# EAGLE design schematic (EAGLE 9.0.0)
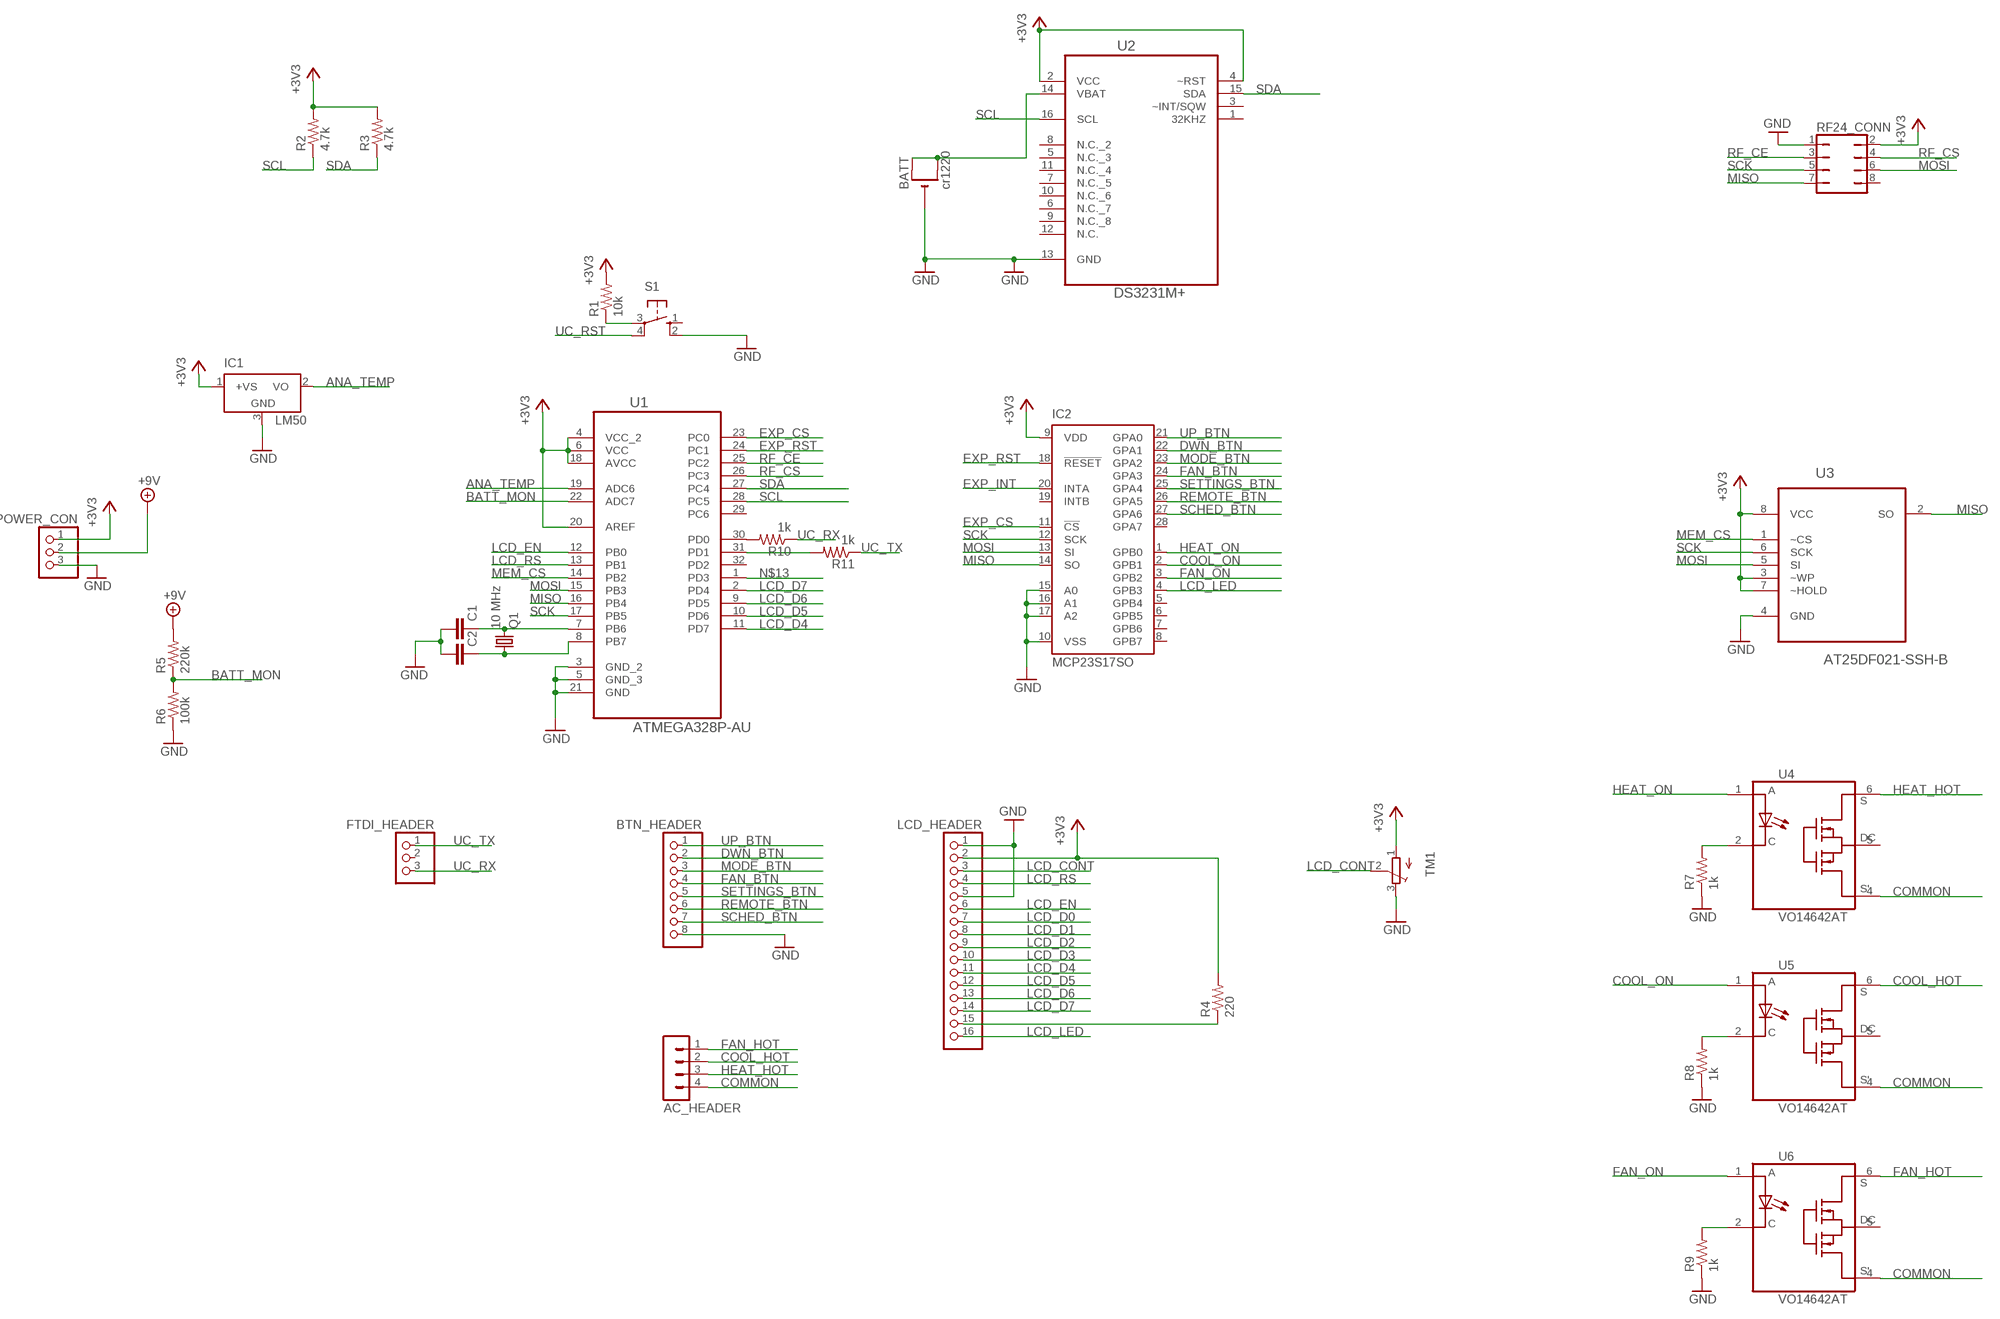
[diagram p0: schematic, sheet 1]

## Parts
AC_HEADER  MA04-1  [MA04-1]
BATT  cr1220  CR1220SMT  [CR1220-SMD]
BTN_HEADER  PINHD-1X8BIG  [1X08-BIG]
C1  C-EUC0402  [C0402]
C2  C-EUC0402  [C0402]
FTDI_HEADER  PINHD-1X3  [1X03]
IC1  LM50  [SOT23]
IC2  MCP23S17SO  [SO28W]
LCD_HEADER  PINHD-1X16  [1X16]
POWER_CON  PINHD-1X3  [1X03]
Q1  10 MHz  FC-12M  [FC-12M]
R1  10k  R-US_R0402  [R0402]
R2  4.7k  R-US_R0402  [R0402]
R3  4.7k  R-US_R0402  [R0402]
R4  220  R-US_R0402  [R0402]
R5  220k  R-US_R0402  [R0402]
R6  100k  R-US_R0402  [R0402]
R7  1k  R-US_R0402  [R0402]
R8  1k  R-US_R0402  [R0402]
R9  1k  R-US_R0402  [R0402]
R10  1k  R-US_R0402  [R0402]
R11  1k  R-US_R0402  [R0402]
RF24_CONN  JP4Q  [JP4Q]
S1  10-XX  [B3F-10XX]
TM1  TRIMPOTTC33X  [TC33X]
U1  ATMEGA328P-AU  [QFP80P900X900X120-32N]
U2  DS3231M+  [SOIC127P1032X265-16N]
U3  AT25DF021-SSH-B  [SOIC127P600X175-8N]
U4  VO14642AT  [DIP762W50P254L730H410Q6]
U5  VO14642AT  [DIP762W50P254L730H410Q6]
U6  VO14642AT  [DIP762W50P254L730H410Q6]

## Nets
+3V3: IC1.1(+VS) IC2.9(VDD) LCD_HEADER.2 POWER_CON.1 R1.2 R2.2 R3.2 R4.2 RF24_CONN.2 TM1.1(A) U1.4(VCC_2) U1.6(VCC) U1.18(AVCC) U1.20(AREF) U2.2(VCC) U2.4(~RST) U3.3(~WP) U3.7(~HOLD) U3.8(VCC)
+9V: POWER_CON.2 R5.2
ANA_TEMP: IC1.2(VO) U1.19(ADC6)
BATT_MON: R5.1 R6.2 U1.22(ADC7)
COMMON: AC_HEADER.4 U4.4(S') U5.4(S') U6.4(S')
COOL_HOT: AC_HEADER.2 U5.6(S)
COOL_ON: IC2.2(GPB1) U5.1(A)
DWN_BTN: BTN_HEADER.2 IC2.22(GPA1)
EXP_CS: IC2.11(!CS) U1.23(PC0)
EXP_INT: IC2.20(INTA)
EXP_RST: IC2.18(!RESET) U1.24(PC1)
FAN_BTN: BTN_HEADER.4 IC2.24(GPA3)
FAN_HOT: AC_HEADER.1 U6.6(S)
FAN_ON: IC2.3(GPB2) U6.1(A)
GND: BATT.- BTN_HEADER.8 C1.2 C2.2 IC1.3(GND) IC2.10(VSS) IC2.15(A0) IC2.16(A1) IC2.17(A2) LCD_HEADER.1 LCD_HEADER.5 POWER_CON.3 R6.1 R7.1 R8.1 R9.1 RF24_CONN.1 S1.2(S1) TM1.3(E) U1.3(GND_2) U1.5(GND_3) U1.21(GND) U2.13(GND) U3.4(GND)
HEAT_HOT: AC_HEADER.3 U4.6(S)
HEAT_ON: IC2.1(GPB0) U4.1(A)
LCD_CONT: LCD_HEADER.3 TM1.2(S)
LCD_D0: LCD_HEADER.7
LCD_D1: LCD_HEADER.8
LCD_D2: LCD_HEADER.9
LCD_D3: LCD_HEADER.10
LCD_D4: LCD_HEADER.11 U1.11(PD7)
LCD_D5: LCD_HEADER.12 U1.10(PD6)
LCD_D6: LCD_HEADER.13 U1.9(PD5)
LCD_D7: LCD_HEADER.14 U1.2(PD4)
LCD_EN: LCD_HEADER.6 U1.12(PB0)
LCD_LED: IC2.4(GPB3) LCD_HEADER.16
LCD_RS: LCD_HEADER.4 U1.13(PB1)
MEM_CS: U1.14(PB2) U3.1(~CS)
MISO: IC2.14(SO) RF24_CONN.7 U1.16(PB4) U3.2(SO)
MODE_BTN: BTN_HEADER.3 IC2.23(GPA2)
MOSI: IC2.13(SI) RF24_CONN.6 U1.15(PB3) U3.5(SI)
N$1: C1.1 Q1.2 U1.7(PB6)
N$2: C2.1 Q1.1 U1.8(PB7)
N$3: LCD_HEADER.15 R4.1
N$4: R1.1 S1.3(P)
N$5: R7.2 U4.2(C)
N$6: R8.2 U5.2(C)
N$7: R9.2 U6.2(C)
N$8: BATT.+$1(+) BATT.+$2(+1) U2.14(VBAT)
N$9: R10.2 U1.30(PD0)
N$10: R11.2 U1.31(PD1)
N$13: U1.1(PD3)
REMOTE_BTN: BTN_HEADER.6 IC2.26(GPA5)
RF_CE: RF24_CONN.3 U1.25(PC2)
RF_CS: RF24_CONN.4 U1.26(PC3)
SCHED_BTN: BTN_HEADER.7 IC2.27(GPA6)
SCK: IC2.12(SCK) RF24_CONN.5 U1.17(PB5) U3.6(SCK)
SCL: R2.1 U1.28(PC5) U2.16(SCL)
SDA: R3.1 U1.27(PC4) U2.15(SDA)
SETTINGS_BTN: BTN_HEADER.5 IC2.25(GPA4)
UC_RST: S1.4(P1)
UC_RX: FTDI_HEADER.3 R10.1
UC_TX: FTDI_HEADER.1 R11.1
UP_BTN: BTN_HEADER.1 IC2.21(GPA0)
Unconnected: FTDI_HEADER.2 IC2.5(GPB4) IC2.6(GPB5) IC2.7(GPB6) IC2.8(GPB7) IC2.19(INTB) IC2.28(GPA7) RF24_CONN.8 S1.1(S) U1.29(PC6) U1.32(PD2) U2.1(32KHZ) U2.3(~INT/SQW) U2.5(N.C._3) U2.6(N.C._7) U2.7(N.C._5) U2.8(N.C._2) U2.9(N.C._8) U2.10(N.C._6) U2.11(N.C._4) U2.12(N.C.) U4.5(DC) U5.5(DC) U6.5(DC)

## Library data of the parts
AC_HEADER = con-lstb:MA04-1: PIN HEADER; OC_FARNELL: unknown; OC_NEWARK: unknown
BATT = adafruit:CR1220: CR1216/CR1220/CR1225 12mm 3V lithium coin cell Great for battery packup. Both SMT and THM holders. Note the THM package has the ground pads on both sides of the PCB so that the masks are the same - this reduces the cost
BTN_HEADER = adafruit:PINHD-1X8: PIN HEADER
C1 C2 = rcl:C-EU: CAPACITOR, European symbol; SPICEPREFIX: C
FTDI_HEADER POWER_CON = adafruit:PINHD-1X3: PIN HEADER
IC1 = linear:LM50: SOT-23 Single-Supply Centigrade Temperature Sensor Vout = (10mV/°C x Temp °C) +5mmmV Source: http://cache.national.com/ds/LM/LM50.pdf
IC2 = microchip:MCP23S17: http://ww1.microchip.com/downloads/en/DeviceDoc/21952a.pdf Source: http://ww1.microchip.com/downloads/en/DeviceDoc/21952a.pdf; MF: MICROCHIP; MPN: MCP23S17-E/SO; OC_FARNELL: unknown; OC_NEWARK: 31K2950
LCD_HEADER = pinhead:PINHD-1X16: PIN HEADER
Q1 = crystal:FC-12M: kHz RANGE CRYSTAL UNIT LOW PROFILE SMD Source: Epson Toyocom FC-12M.pdf
R1-R11 = resistor:R-US_: RESISTOR, American symbol
RF24_CONN = jumper:JP4Q: JUMPER
S1 = switch-omron:10-XX: OMRON SWITCH; MPN: B3F-1000; OC_FARNELL: 176432; OC_NEWARK: 36M3542
TM1 = adafruit:TRIMPOT: SMT trimmer potentiometer part number TC33X http://www.ladyada.net/library/eagle
U1 = Atmel_By_element14_Batch_1-00:ATMEGA328P-AU: 8-bit Microcontroller with In-System Programmable Flash; MPN: ATMEGA328P-AU; OC_FARNELL: 1715486; OC_NEWARK: 14R4631; PACKAGE: TQFP-32; SUPPLIER: Atmel
U2 = Maxim_By_element14_Batch_1:DS3231M+: ±5ppm, I2C Real-Time Clock; MPN: DS3231M+; OC_FARNELL: -; OC_NEWARK: 79R7965; PACKAGE: SO-16; SUPPLIER: Maxim
U3 = Atmel_By_element14_Batch_1-00:AT25DF021-SSH-B: 2-Megabit Minimum SPI Serial Flash Memory; MPN: AT25DF021-SSH-B; OC_FARNELL: 1715438; OC_NEWARK: 15R0303; PACKAGE: SOIC-8; SUPPLIER: Atmel
U4-U6 = VO14642AT:VO14642AT; DESCRIPTION: VO14642 Series SPST-NO 50 mA 60 V Through Hole Solid State Relay - DIP-6; DIGI-KEY_PART_NUMBER: VO14642AT-ND; DIGI-KEY_PURCHASE_URL: https://www.digikey.com/product-detail/en/vishay-semiconductor-opto-division/VO14642AT/VO14642AT-ND/4074374?utm_source=snapeda&utm_medium=aggregator&utm_campaign=symbol; MF: Vishay; MP: VO14642AT; PACKAGE: DIP-6 Vishay

## Board
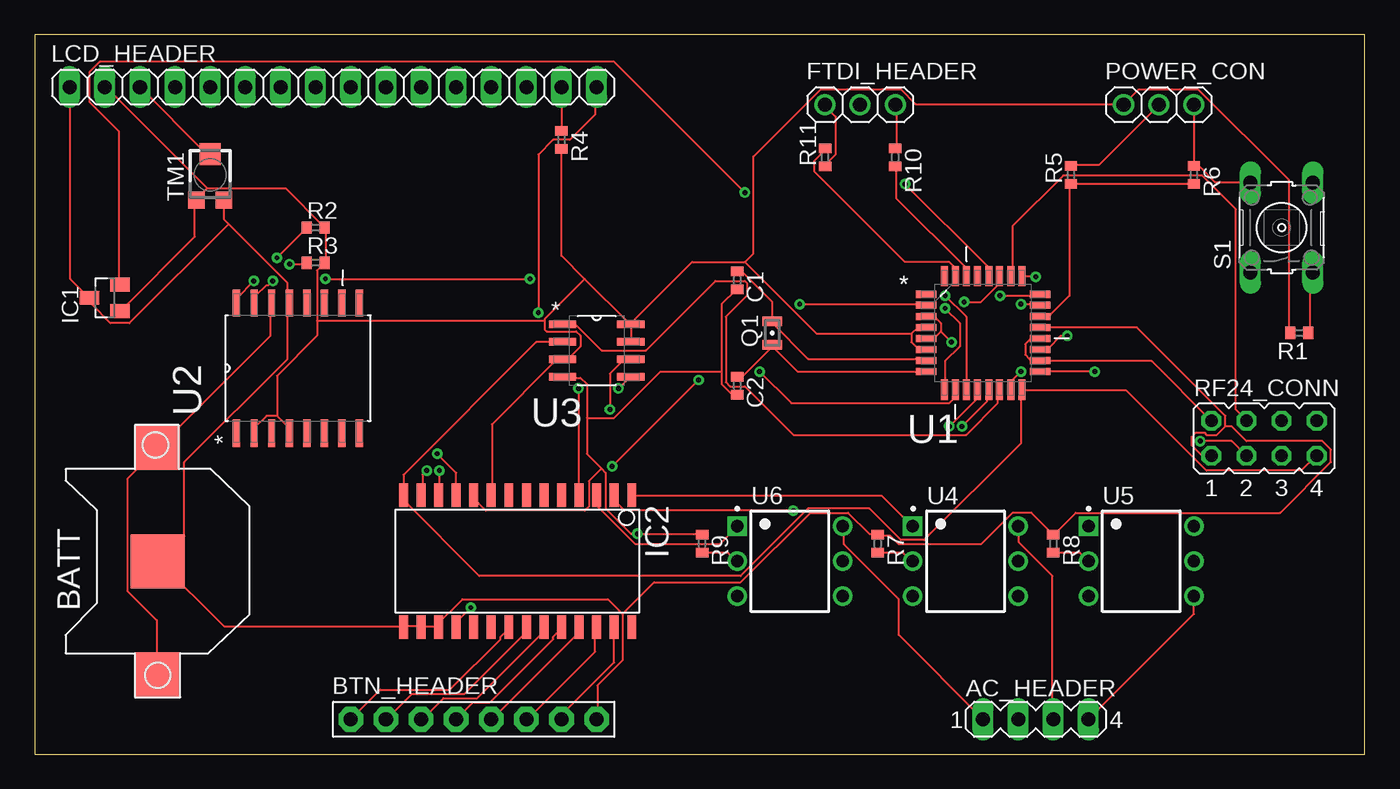
[diagram p1: board, top side]
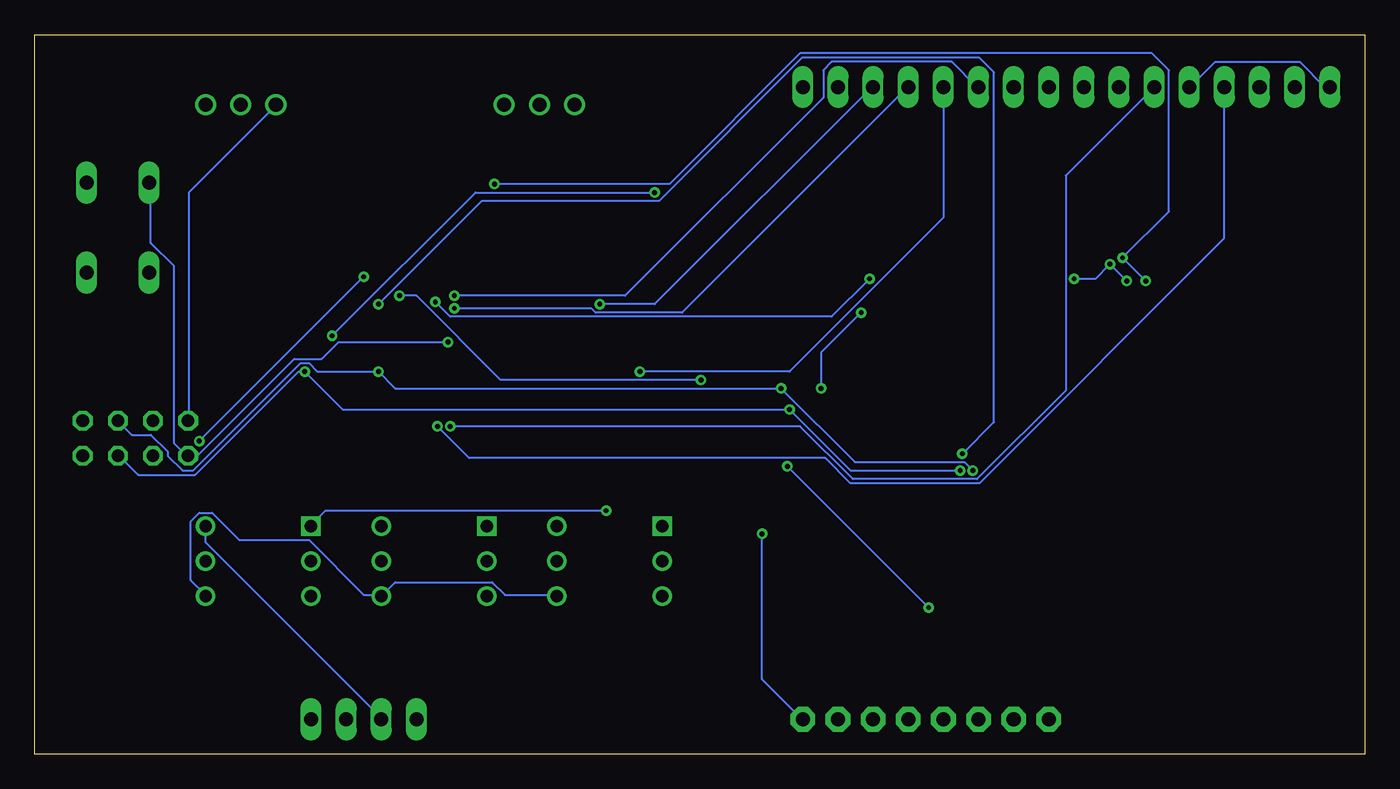
[diagram p2: board, bottom side, seen from below]

Size 96.19 x 52.06 mm. Coordinates in mm from the lower left corner, seen from the top.
Outline: 0,0 96.19,0 96.19,52.06 0,52.06 0,0
Copper layers (1*16): Top 0.035mm / dielectric 1.5mm / Bottom 0.035mm
Design rules "default": minimum track width 6mil, minimum drill 0.35mm, track to track 6mil, track to pad 6mil, pad to pad 6mil, via to via 6mil, smd to smd 6mil, copper to edge 40mil, drill to drill 6mil, minimum pad ring 10mil, minimum via ring 8mil, stop-mask expansion 4mil, vias tented up to drill 0mil, thermal gap 10mil

### Footprints (pad centres in the part's own frame; a part is rotated, then mirrored left to right if it is on the bottom)
MA04-1 = drill 1.016 long: 1 -3.81,0; 2 -1.27,0; 3 1.27,0; 4 3.81,0
CR1220-SMD = smd 3.2 x 3.2: +$1 -8.2,0; +$2 8.2,0 | smd 3.9 x 3.9: - 0,0
1X08-BIG = drill 1.016 pad 1.778 octagon: 1 -8.89,0; 2 -6.35,0; 3 -3.81,0; 4 -1.27,0; 5 1.27,0; 6 3.81,0; 7 6.35,0; 8 8.89,0
C0402 = smd 0.7 x 0.9: 1 -0.65,0; 2 0.65,0
1X03 = drill 1.016: 1 -2.54,0; 2 0,0; 3 2.54,0
SOT23 = smd 1 x 1.4: 1 -0.95,-1.1; 2 0.95,-1.1; 3 0,1.1
SO28W = smd 0.65 x 1.7: 1 -7.62,-4.78; 2 -6.35,-4.78; 3 -5.08,-4.78; 4 -3.81,-4.78; 5 -2.54,-4.78; 6 -1.27,-4.78; 7 0,-4.78; 8 1.27,-4.78; 9 2.54,-4.78; 10 3.81,-4.78; 11 5.08,-4.78; 12 6.35,-4.78; 13 7.62,-4.78; 14 8.89,-4.78; 15 8.89,4.78; 16 7.62,4.78; 17 6.35,4.78; 18 5.08,4.78; 19 3.81,4.78; 20 2.54,4.78; 21 1.27,4.78; 22 0,4.78; 23 -1.27,4.78; 24 -2.54,4.78; 25 -3.81,4.78; 26 -5.08,4.78; 27 -6.35,4.78; 28 -7.62,4.78
1X16 = drill 1.016 long: 1 -19.05,0; 2 -16.51,0; 3 -13.97,0; 4 -11.43,0; 5 -8.89,0; 6 -6.35,0; 7 -3.81,0; 8 -1.27,0; 9 1.27,0; 10 3.81,0; 11 6.35,0; 12 8.89,0; 13 11.43,0; 14 13.97,0; 15 16.51,0; 16 19.05,0
FC-12M = smd 0.7 x 1.4: 1 -0.85,0; 2 0.85,0
R0402 = smd 0.7 x 0.9: 1 -0.65,0; 2 0.65,0
JP4Q = drill 0.914 octagon: 1 -3.81,-1.27; 2 -3.81,1.27; 3 -1.27,-1.27; 4 -1.27,1.27; 5 1.27,-1.27; 6 1.27,1.27; 7 3.81,-1.27; 8 3.81,1.27
B3F-10XX = drill 1.016 long: 1 -3.251,2.261; 2 3.251,2.261; 3 -3.251,-2.261; 4 3.251,-2.261
TC33X = smd 1.2 x 1.2: 1 -1,-1.825; 3 1,-1.825 | smd 1.5 x 1.6: 2 0,1.5
QFP80P900X900X120-32N = smd 1.473 x 0.508: 1 -4.115,2.794; 2 -4.115,2.007; 3 -4.115,1.194; 4 -4.115,0.406; 5 -4.115,-0.406; 6 -4.115,-1.194; 7 -4.115,-2.007; 8 -4.115,-2.794; 17 4.115,-2.794; 18 4.115,-2.007; 19 4.115,-1.194; 20 4.115,-0.406; 21 4.115,0.406; 22 4.115,1.194; 23 4.115,2.007; 24 4.115,2.794 | smd 0.508 x 1.473: 9 -2.794,-4.115; 10 -2.007,-4.115; 11 -1.194,-4.115; 12 -0.406,-4.115; 13 0.406,-4.115; 14 1.194,-4.115; 15 2.007,-4.115; 16 2.794,-4.115; 25 2.794,4.115; 26 2.007,4.115; 27 1.194,4.115; 28 0.406,4.115; 29 -0.406,4.115; 30 -1.194,4.115; 31 -2.007,4.115; 32 -2.794,4.115
SOIC127P1032X265-16N = smd 1.981 x 0.533: 1 -4.699,4.445; 2 -4.699,3.175; 3 -4.699,1.905; 4 -4.699,0.635; 5 -4.699,-0.635; 6 -4.699,-1.905; 7 -4.699,-3.175; 8 -4.699,-4.445; 9 4.699,-4.445; 10 4.699,-3.175; 11 4.699,-1.905; 12 4.699,-0.635; 13 4.699,0.635; 14 4.699,1.905; 15 4.699,3.175; 16 4.699,4.445
SOIC127P600X175-8N = smd 1.981 x 0.559: 1 -2.464,1.905; 2 -2.464,0.635; 3 -2.464,-0.635; 4 -2.464,-1.905; 5 2.464,-1.905; 6 2.464,-0.635; 7 2.464,0.635; 8 2.464,1.905
DIP762W50P254L730H410Q6 = drill 0.9 pad 1.4 square: 1 -3.81,2.54 | drill 0.9 pad 1.4: 2 -3.81,0; 3 -3.81,-2.54; 4 3.81,-2.54; 5 3.81,0; 6 3.81,2.54

### Placement (x,y rotation side)
AC_HEADER  72.39,2.54 0 top
BATT  8.89,13.97 90 top
BTN_HEADER  31.75,2.54 0 top
C1  50.8,34.29 270 top
C2  50.8,26.67 270 top
FTDI_HEADER  59.69,46.99 0 top
IC1  5.08,33.02 90 top
IC2  35.56,13.97 180 top
LCD_HEADER  21.59,48.26 0 top
POWER_CON  81.28,46.99 0 top
Q1  53.34,30.48 90 top
R1  91.44,30.48 180 top
R2  20.32,38.1 0 top
R3  20.32,35.56 0 top
R4  38.1,44.45 270 top
R5  74.93,41.91 90 top
R6  83.82,41.91 270 top
R7  60.96,15.24 270 top
R8  73.66,15.24 270 top
R9  48.26,15.24 270 top
R10  62.23,43.18 270 top
R11  57.15,43.18 90 top
RF24_CONN  88.9,22.86 0 top
S1  90.17,38.1 90 top
TM1  12.7,41.91 0 top
U1  68.58,30.48 0 top
U2  19.05,27.94 90 top
U3  40.64,29.21 0 top
U4  67.31,13.97 0 top
U5  80.01,13.97 0 top
U6  54.61,13.97 0 top

### Tracks (layer width: path | path; a pad name or v marks a point on that pad's centre or on a via)
+3V3
  Top 0.152: 17.53,24.49 16.76,24.49 16,23.72 16,23.27 U2.2 | 17.53,24.49 18.29,23.72 18.29,23.27 U2.4 | IC1.1 6.25,32.11 11.58,37.44 11.58,40.03 TM1.1 11.73,40.18 12.5,40.95 | 12.5,40.95 18.14,40.95 20.88,38.2 R2.2 21.03,38.05 21.03,35.61 R3.2 20.88,35.46 20.42,35 20.42,31.34 | 17.53,24.49 17.53,27.38 20.42,30.28 20.42,31.34 | 12.5,40.95 5.18,48.26 LCD_HEADER.2 | U1.20 72.69,29.97 71.93,29.97 71.63,29.67 71.63,28.9 71.93,28.6 72.69,28.6 U1.18 72.69,28.45 80.77,28.45 RF24_CONN.2 | R1.2 90.68,30.58 90.68,41.55 84.12,48.11 79.86,48.11 POWER_CON.1 78.64,47.04 63.7,47.04 62.64,48.11 56.84,48.11 51.97,43.23 51.97,36.22 51.36,35.61 | IC2.9 33.07,18.85 33.07,23.88 37.64,28.45 38.1,28.45 U3.3 38.25,28.6 38.56,28.6 39.47,29.51 39.47,30.28 39.17,30.58 37.03,30.58 36.88,30.73 36.88,31.34 | 63.4,30.43 63.4,29.82 63.86,29.36 64.47,29.36 U1.6 | 63.4,30.43 63.86,30.89 U1.4 | R4.2 38.1,36.07 39.78,34.39 | 39.78,34.39 42.98,31.19 U3.8 | U3.7 43.13,29.97 43.13,31.04 U3.8 | 63.4,30.43 56.54,30.43 51.36,35.61 | 51.36,35.61 47.55,35.61 43.13,31.19 U3.8 | 36.88,31.34 36.88,31.5 39.78,34.39 | 36.88,31.34 20.42,31.34
  Bottom 0.152: RF24_CONN.2 85.04,24.18 85.04,40.64 78.79,46.89 POWER_CON.1
+9V
  Top 0.152: R5.2 74.98,42.62 76.96,42.62 81.23,46.89 POWER_CON.2
ANA_TEMP  (via drill 0.35)
  Top 0.152: v51.36,40.64 41.91,50.09 4.72,50.09 3.96,49.33 3.96,47.19 6.1,45.06 6.1,34.09 IC1.2 | v74.68,30.28 74.22,30.28 73.3,29.36 72.69,29.36 U1.19
  Bottom 0.152: v51.36,40.64 64.31,40.64 v74.68,30.28
BATT_MON
  Top 0.152: R6.2 74.98,41.25 R5.1 74.83,41.25 74.83,33.17 73.46,31.8 72.69,31.8 U1.22
COMMON
  Top 0.152: U5.4 83.82,10.16 AC_HEADER.4
  Bottom 0.152: U6.4 58.52,11.53 62.18,11.53 63.09,12.45 70.1,12.45 U4.4 71.17,11.53 72.39,11.53 76.35,15.49 81.38,15.49 83.36,17.47 84.28,17.47 84.89,16.87 84.89,12.6 83.82,11.53 U5.4
COOL_HOT
  Bottom 0.152: U5.6 83.82,15.34 71.02,2.54 AC_HEADER.2
COOL_ON  (via drill 0.35)
  Top 0.152: IC2.2 41.91,18.39 42.67,17.63 v54.86,17.63
  Bottom 0.152: v54.86,17.63 75.13,17.63 76.2,16.56 U5.1
DWN_BTN
  Top 0.152: IC2.22 35.51,9.09 35.51,8.79 31.09,4.37 27.28,4.37 25.45,2.54 BTN_HEADER.2
EXP_CS  (via drill 0.35)
  Top 0.152: v71.32,32.56 72.69,32.56 U1.23 | v29.11,21.74 30.48,20.37 IC2.11
  Bottom 0.152: v71.32,32.56 63.86,40.03 51.05,40.03 40.69,50.39 27.89,50.39 26.82,49.33 26.82,24.03 v29.11,21.74
EXP_RST  (via drill 0.35)
  Top 0.152: v69.8,33.17 72.69,33.17 U1.24 | v41.76,20.83 v48.01,27.08 | v31.55,10.62 30.48,9.55 IC2.18
  Bottom 0.152: v69.8,33.17 68.58,33.17 62.48,27.08 v48.01,27.08 | v31.55,10.62 v41.76,20.83
FAN_BTN
  Top 0.152: BTN_HEADER.4 31.7,3.76 32.92,3.76 37.49,8.33 37.49,8.48 38.1,9.09 IC2.24
FAN_HOT
  Top 0.152: AC_HEADER.1 62.48,8.64 62.48,11.23 58.52,15.19 58.52,16.41 U6.6
FAN_ON
  Top 0.152: IC2.3 40.69,18.69 40.69,17.93 43.43,15.19 49.53,15.19 50.75,16.41 U6.1
GND  (via drill 0.35)
  Top 0.152: POWER_CON.3 R6.1 83.82,42.47 84.28,42.47 85.34,41.4 87.78,41.4 S1.2 | 65.53,30.58 65.08,30.12 64.47,30.12 U1.5 | 65.53,30.58 65.53,31.19 65.08,31.65 64.47,31.65 U1.3 | U1.21 79.7,30.89 86.11,24.49 86.11,23.72 | 86.11,23.72 85.5,23.11 84.73,23.11 84.58,23.27 83.97,23.27 83.67,22.96 83.67,22.35 84.43,21.59 RF24_CONN.1 | v66.29,29.82 65.53,30.58 | 49.68,27.69 49.68,32.56 50.75,33.63 C1.2 | 49.68,27.69 49.68,26.77 50.29,26.16 50.75,26.16 C2.2 | 41,20.68 39.93,21.74 39.93,24.33 | 41,20.68 41.3,20.37 41.3,17.78 43.13,15.95 v43.59,15.95 48.16,15.95 R9.1 | 39.93,24.33 39.93,26.77 39.47,27.23 38.25,27.23 U3.4 | 41,20.68 40.08,19.76 40.08,17.93 39.78,17.63 32.61,17.63 31.85,18.39 31.85,18.69 IC2.10 | 49.68,27.69 45.26,27.69 41.91,24.33 39.93,24.33 | 14.02,38.35 18.29,34.09 18.29,32.72 U2.13 18.29,32.56 18.29,28.6 10.82,21.13 10.82,15.8 8.99,13.97 | 14.02,38.35 13.72,38.66 13.72,40.03 TM1.3 | 14.02,38.35 6.86,31.19 5.49,31.19 4.12,32.56 4.12,33.02 IC1.3 3.96,33.02 2.59,34.39 2.59,48.26 LCD_HEADER.1 | 26.67,9.25 27.89,9.25 IC2.16 28.04,9.25 28.96,9.25 | 28.96,9.25 29.11,9.25 IC2.17 28.96,9.25 | 26.67,9.25 13.72,9.25 8.99,13.97 | 26.67,9.25 IC2.15 | 42.52,10.16 42.52,6.81 40.69,4.98 40.69,2.54 BTN_HEADER.8 | 42.52,10.16 41.45,11.23 30.94,11.23 28.96,9.25 | 42.52,10.16 44.81,12.45 51.05,12.45 56.08,17.47 58.83,17.47 60.35,15.95 60.96,15.95 R7.1 60.96,15.8 61.87,15.8 62.48,15.19 68.43,15.19 70.71,17.47 72.08,17.47 73.61,15.95 R8.1 73.76,15.95 75.29,17.47 90.07,17.47 93.73,21.13 93.73,22.05 93.12,22.66 87.63,22.66 86.56,23.72 86.11,23.72 | 8.99,13.97 BATT.-
  Bottom 0.152: v66.29,29.82 74.22,29.82 75.44,28.6 77.42,28.6 84.43,21.59 RF24_CONN.1 85.19,21.59 86.11,22.5 86.11,35.31 87.78,36.98 87.78,41.25 S1.2 | LCD_HEADER.1 2.9,48.26 4.72,50.09 10.82,50.09 12.65,48.26 LCD_HEADER.5 | v43.59,15.95 43.59,5.44 40.69,2.54 BTN_HEADER.8
HEAT_HOT
  Top 0.152: U4.6 71.17,16.41 71.17,15.34 73.61,12.9 73.61,2.54 AC_HEADER.3
HEAT_ON
  Top 0.152: IC2.1 43.28,18.69 61.27,18.69 63.4,16.56 U4.1
LCD_CONT
  Top 0.152: LCD_HEADER.3 12.34,43.54 12.65,43.54 TM1.2
LCD_D4  (via drill 0.35)
  Top 0.152: v65.84,33.17 67.36,31.65 67.36,26.47 U1.11
  Bottom 0.152: v65.84,33.17 53.49,33.17 39.17,47.5 39.17,49.48 38.56,50.09 29.87,50.09 28.04,48.26 LCD_HEADER.11
LCD_D5  (via drill 0.35)
  Top 0.152: v52.43,27.69 54.71,25.4 66.14,25.4 66.45,25.71 66.45,26.31 U1.10
  Bottom 0.152: v52.43,27.69 41.6,27.69 30.48,38.81 LCD_HEADER.12
LCD_D6  (via drill 0.35)
  Top 0.152: v65.84,32.26 66.9,31.19 66.9,29.51 65.84,28.45 65.84,26.47 U1.9
  Bottom 0.152: v65.84,32.26 55.93,32.26 55.63,31.95 49.38,31.95 33.07,48.26 LCD_HEADER.13
LCD_D7  (via drill 0.35)
  Top 0.152: v55.32,32.56 64.47,32.56 U1.2
  Bottom 0.152: v55.32,32.56 51.36,32.56 35.66,48.26 LCD_HEADER.14
LCD_EN  (via drill 0.35)
  Top 0.152: v66.14,23.72 68.12,25.71 68.12,26.31 U1.12
  Bottom 0.152: v66.14,23.72 40.84,23.72 37.03,19.91 28.04,19.91 21.64,26.31 21.64,41.86 LCD_HEADER.6
LCD_LED  (via drill 0.35)
  Top 0.152: v39.32,26.47 39.32,18.85 IC2.4 | v36.42,31.95 36.42,43.38 37.49,44.45 38.71,44.45 40.54,46.28 40.54,48.26 LCD_HEADER.16
  Bottom 0.152: v39.32,26.47 39.32,29.06 v36.42,31.95
LCD_RS  (via drill 0.35)
  Top 0.152: v67.06,23.72 68.88,25.55 68.88,26.31 U1.13
  Bottom 0.152: v67.06,23.72 64.77,21.44 39.01,21.44 37.19,19.61 27.89,19.61 10.21,37.29 10.21,48.26 LCD_HEADER.4
MEM_CS
  Top 0.152: U1.14 69.65,26.31 69.65,25.4 67.36,23.11 54.86,23.11 51.36,26.62 50.29,26.62 49.99,26.92 49.99,31.65 51.51,33.17 51.51,34.09 51.36,34.24 49.22,34.24 44.2,29.21 41,29.21 39.17,31.04 38.25,31.04 U3.1
MISO
  Top 0.152: U3.2 38.1,29.82 36.27,29.82 26.67,20.22 IC2.14 26.67,18.39 32.16,12.9 51.05,12.9 55.93,17.78 60.35,17.78 62.64,15.49 64.31,15.49 71.32,22.5 71.32,26.31 U1.16 71.48,26.31 78.94,26.31 84.73,20.52 91.59,20.52 92.66,21.59 RF24_CONN.7
MODE_BTN
  Top 0.152: IC2.23 36.73,9.09 36.73,8.79 32,4.06 29.57,4.06 28.04,2.54 BTN_HEADER.3
MOSI  (via drill 0.35)
  Top 0.152: v28.35,20.52 28.04,20.22 28.04,18.85 IC2.13 | v42.21,26.47 42.98,27.23 U3.5 | v71.32,27.69 70.71,27.08 70.71,26.47 U1.15
  Bottom 0.152: v28.35,20.52 28.96,21.13 36.88,21.13 v42.21,26.47 70.1,26.47 v71.32,27.69 75.74,27.69 76.35,28.3 76.96,28.3 84.73,20.52 85.5,20.52 86.56,21.59 86.56,21.89 87.78,23.11 89.15,23.11 RF24_CONN.6
N$1
  Top 0.152: C1.1 50.9,34.85 51.21,34.85 53.34,32.72 Q1.2 53.34,31.19 55.93,28.6 64.47,28.6 U1.7
N$2
  Top 0.152: 53.34,29.51 51.21,27.38 50.9,27.38 C2.1 | U1.8 55.17,27.69 53.34,29.51 | 53.34,29.51 Q1.1
N$3
  Top 0.152: LCD_HEADER.15 R4.1
N$4
  Top 0.152: R1.1 92.2,30.58 92.2,34.7 92.35,34.85 S1.3
N$5
  Top 0.152: R7.2 62.79,14.58 63.4,13.97 U4.2
N$6
  Top 0.152: U5.2 75.59,14.58 73.76,14.58 R8.2
N$7
  Top 0.152: R9.2 48.31,14.58 50.14,14.58 50.75,13.97 U6.2
N$8
  Top 0.152: U2.14 17.07,32.56 17.07,30.28 8.99,22.2 BATT.+$2 8.84,22.05 6.71,19.91 6.71,11.84 8.84,9.7 8.84,5.89 BATT.+$1
N$9
  Top 0.152: R10.2 62.33,42.47 62.33,40.18 67.36,35.15 67.36,34.7 U1.30
N$10
  Top 0.152: R11.2 57.15,43.69 56.39,42.93 56.39,42.16 62.94,35.61 66.14,35.61 66.45,35.31 66.45,34.7 U1.31
REMOTE_BTN
  Top 0.152: IC2.26 40.54,9.09 40.54,7.42 35.66,2.54 BTN_HEADER.6
RF_CE  (via drill 0.35)
  Top 0.152: v72.39,34.54 71.48,34.54 U1.25 | v84.28,22.66 86.56,22.66 RF24_CONN.3
  Bottom 0.152: v84.28,22.66 v72.39,34.54
RF_CS
  Top 0.152: U1.26 70.71,34.7 70.71,38.2 74.37,41.86 84.43,41.86 86.87,39.42 86.87,24.94 87.63,24.18 RF24_CONN.4
SCHED_BTN
  Top 0.152: IC2.27 41.91,6.65 38.1,2.84 BTN_HEADER.7
SCK  (via drill 0.35)
  Top 0.152: v29.26,20.52 29.26,18.85 IC2.12 | v41.6,24.94 41.6,27.53 42.52,28.45 42.98,28.45 U3.6 | v76.66,27.69 U1.17
  Bottom 0.152: v29.26,20.52 37.19,20.52 v41.6,24.94 73.91,24.94 v76.66,27.69 77.11,27.69 84.58,20.22 88.7,20.22 90.07,21.59 RF24_CONN.5
SCL  (via drill 0.35)
  Top 0.152: v17.53,35.92 19.66,38.05 R2.1 | v15.85,34.24 14.63,33.02 14.63,32.72 U2.16 | v62.94,41.25 68.88,35.31 68.88,34.7 U1.28
  Bottom 0.152: v15.85,34.24 v17.53,35.92 14.17,39.27 14.17,49.48 15.39,50.7 40.84,50.7 50.29,41.25 v62.94,41.25
SDA  (via drill 0.35)
  Top 0.152: v18.44,35.46 19.66,35.46 R3.1 | v17.22,34.24 16.92,33.93 16.76,33.93 16,33.17 16,32.72 U2.15 | v67.21,32.72 68.43,32.72 69.65,33.93 69.65,34.54 U1.27 | v21.03,34.39 v35.81,34.39
  Bottom 0.152: v17.22,34.24 v18.44,35.46 19.51,34.39 v21.03,34.39 | v67.21,32.72 66.14,31.65 38.56,31.65 v35.81,34.39
SETTINGS_BTN
  Top 0.152: IC2.25 39.32,9.09 39.32,8.79 33.07,2.54 BTN_HEADER.5
UC_RX
  Top 0.152: R10.1 62.33,43.84 62.33,46.89 FTDI_HEADER.3
UC_TX
  Top 0.152: R11.1 57.15,42.62 57.91,43.38 57.91,46.13 57.15,46.89 FTDI_HEADER.1
UP_BTN
  Top 0.152: BTN_HEADER.1 24.99,4.67 30.02,4.67 33.68,8.33 33.68,8.48 34.29,9.09 IC2.21